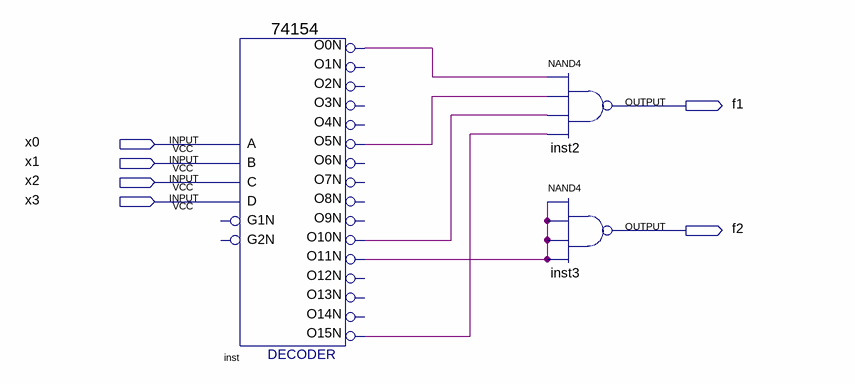
[diagram p0: schematic sheet]
// Quartus schematic lab7b.bdf as structural Verilog: 3 symbols, 6 pins
module lab7b (
  input  x0,
  input  x1,
  input  x2,
  input  x3,
  output f1,
  output f2
);

  wire inst_o0n, inst_o5n, inst_o10n, inst_o11n, inst_o15n;

  \74154  inst (
    .C(x2), .D(x3), .B(x1), .A(x0), .O0N(inst_o0n), .O15N(inst_o15n), .O10N(inst_o10n), .O11N(inst_o11n),
    .O5N(inst_o5n));  // open: G1N, G2N, O12N, O1N, O13N, O14N, O4N, O3N, O2N, O7N, O6N, O9N, O8N
  nand inst2 (f1, inst_o0n, inst_o5n, inst_o10n, inst_o15n);
  nand inst3 (f2, inst_o11n, inst_o11n, inst_o11n, inst_o11n);
endmodule
